# EAGLE design Rauchmelder 1.3 (EAGLE 5.04)
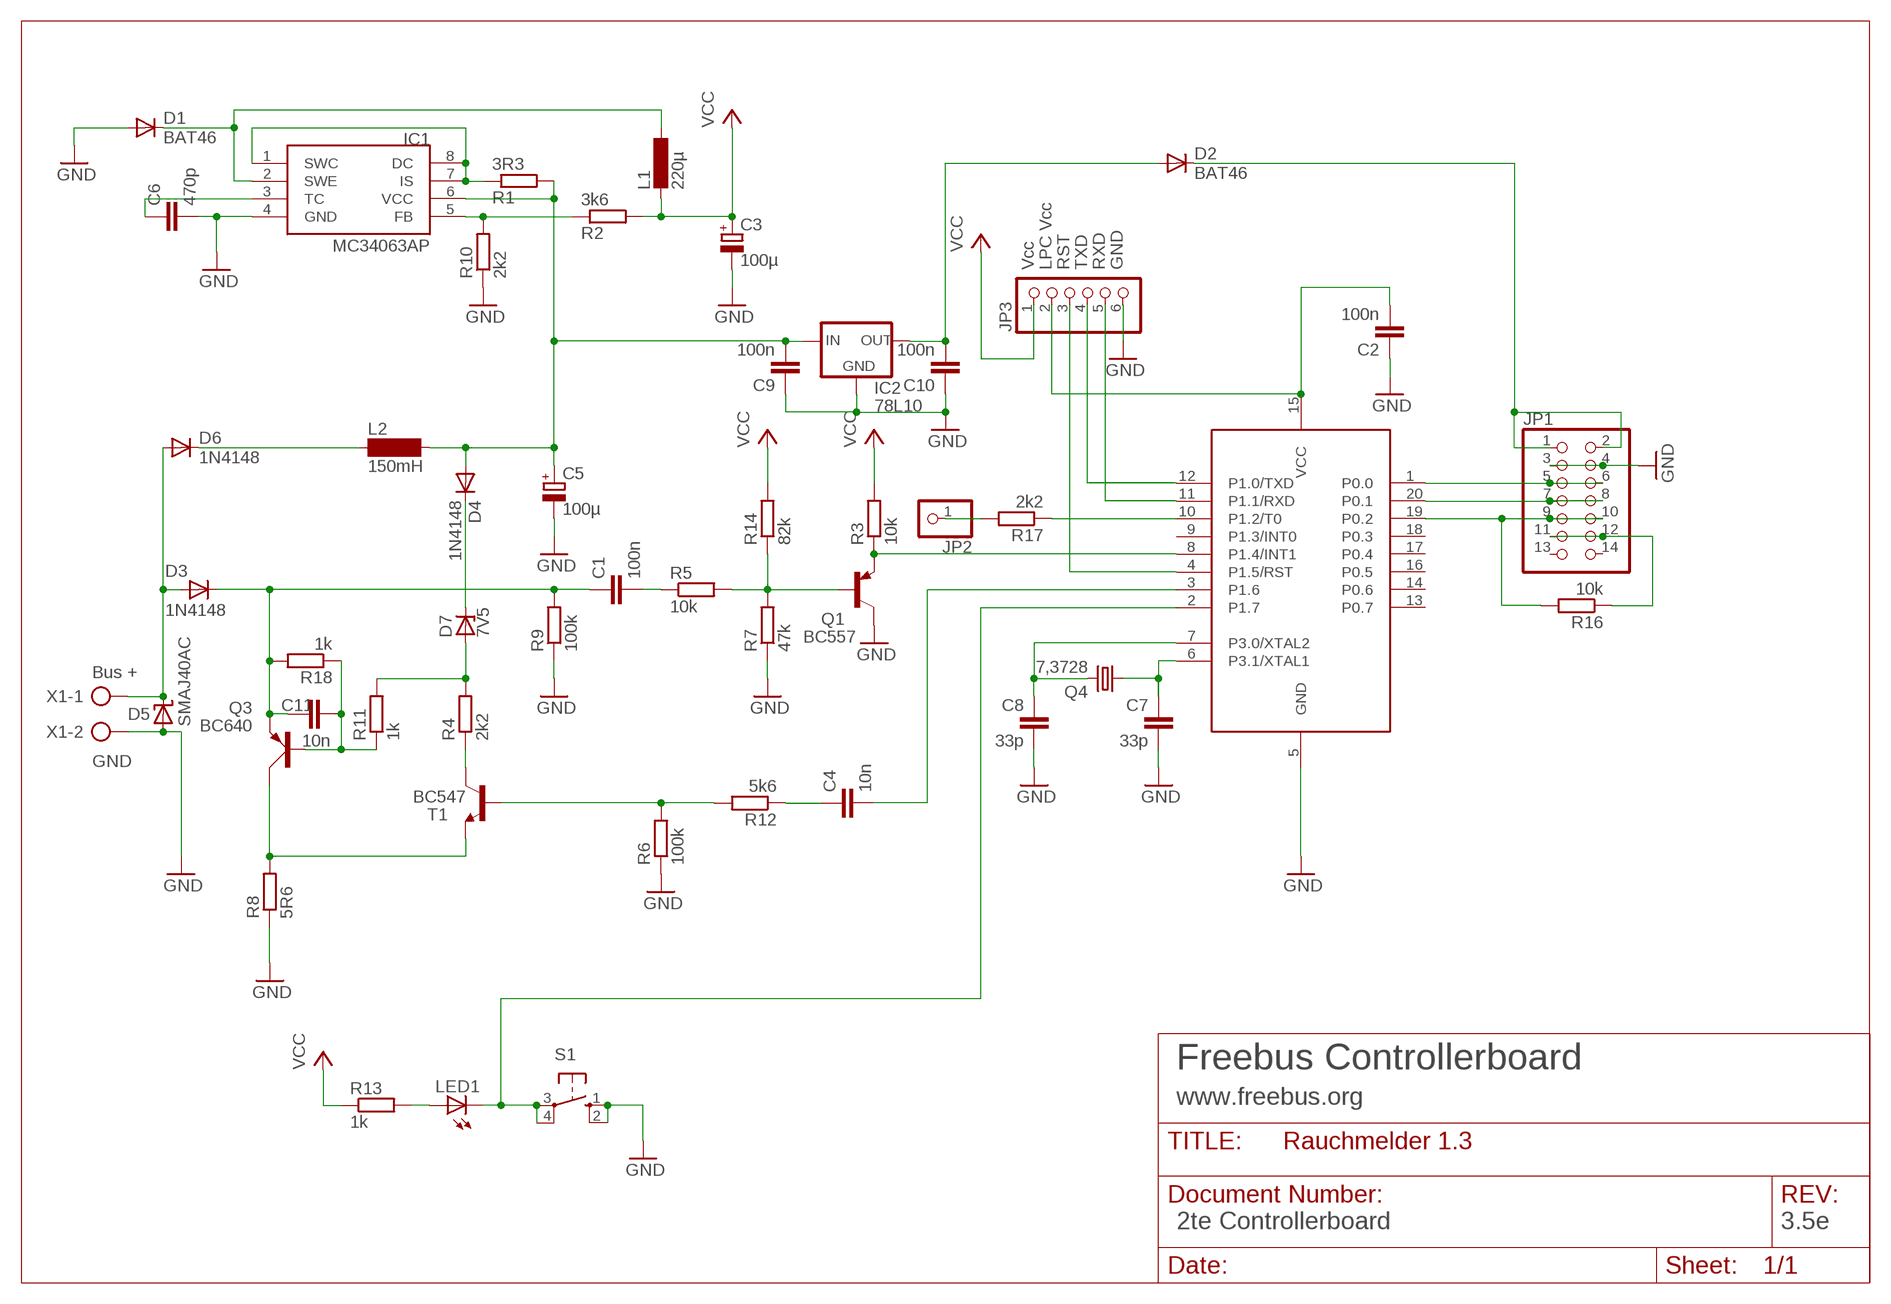
[diagram p0: schematic, sheet 1]

## Parts
89LPC922  89LPC922  [DIL20]
C1  100n  C-EU025-024X044  [C025-024X044]
C2  100n  C-EU025-024X044  [C025-024X044]
C3  100µ  CPOL-EUE2.5-6  [E2,5-6]
C4  10n  C-EU025-024X044  [C025-024X044]
C5  100µ  CPOL-EUE3.5-8  [E3,5-8]
C6  470p  C-EU025-024X044  [C025-024X044]
C7  33p  C-EU025-024X044  [C025-024X044]
C8  33p  C-EU025-024X044  [C025-024X044]
C9  100n  C-EU025-024X044  [C025-024X044]
C10  100n  C-EU025-024X044  [C025-024X044]
C11  10n  C-EU025-024X044  [C025-024X044]
D1  BAT46  BAT81  [DO34-7]
D2  BAT46  BAT81  [DO34-7]
D3  1N4148  DO35-STEHEND  [DO35-S]
D4  1N4148  [DO35-10]
D5  SMAJ40AC  SUPPRESSOR-SMBJ  [SMBJ]
D6  1N4148  [DO35-10]
D7  7V5  BZX85ZDIOV  [ZDIO-2.5]
IC1  MC34063AP  [DIL08]
IC2  78L10  78LXX  [78LXX]
JP1  PINHD-2X7  [2X07]
JP2  PINHD-1X1  [1X01]
JP3  PINHD-1X6  [1X06]
L1  220µ  L-EU0207/12  [0207/12]
L2  150mH  BS11  [BS11]
LED1  LED3MM  [LED3MM]
Q1  BC557  [TO92]
Q3  BC640  [SOT54D]
Q4  7,3728  CRYSTALHC49S  [HC49/S]
R1  3R3  R-EU_0207/7  [0207/7]
R2  3k6  R-EU_0207/7  [0207/7]
R3  10k  R-EU_0207/7  [0207/7]
R4  2k2  R-EU_0207/2V  [0207/2V]
R5  10k  R-EU_0207/7  [0207/7]
R6  100k  R-EU_0207/2V  [0207/2V]
R7  47k  R-EU_0207/7  [0207/7]
R8  5R6  R-EU_0207/7  [0207/7]
R9  100k  R-EU_0207/7  [0207/7]
R10  2k2  R-EU_0207/7  [0207/7]
R11  1k  R-EU_0207/2V  [0207/2V]
R12  5k6  R-EU_0207/7  [0207/7]
R13  1k  R-EU_0207/7  [0207/7]
R14  82k  R-EU_0207/7  [0207/7]
R16  10k  R-EU_0207/7  [0207/7]
R17  2k2  R-EU_0207/7  [0207/7]
R18  1k  R-EU_0207/2V  [0207/2V]
S1  10-XX  [B3F-10XX]
T1  BC547  [TO92]
X1  AK500/2  [AK500/2]

## Nets
EIB+: D3.P$1(A) D5.C D6.A X1.1
GND: 89LPC922.5(GND) C2.1 C3.- C5.- C6.2 C7.2 C8.2 C9.1 C10.1 D1.A D5.A IC1.4(GND) IC2.GND JP1.3 JP1.4 JP3.6 Q1.3(C) R6.1 R7.1 R8.1 R9.1 R10.1 S1.1(S) S1.2(S1) X1.2
N$1: 89LPC922.8(P1.4/INT1) Q1.1(E) R3.1
N$2: Q1.2(B) R5.2 R7.2 R14.1
N$3: 89LPC922.7(P3.0/XTAL2) C8.1 Q4.2
N$4: C11.2 Q3.B R11.1 R18.1
N$5: 89LPC922.3(P1.6) C4.2
N$6: 89LPC922.6(P3.1/XTAL1) C7.1 Q4.1
N$7: 89LPC922.2(P1.7) LED1.K(C) S1.3(P) S1.4(P1)
N$8: IC1.1(SWC) IC1.7(IS) IC1.8(DC) R1.1
N$9: LED1.A R13.2
N$10: C10.2 D2.A IC2.OUT
N$11: IC1.5(FB) R2.1 R10.2
N$12: D1.C IC1.2(SWE) L1.1
N$13: D6.C L2.1
N$14: C6.1 IC1.3(TC)
N$15: D4.C D7.C
N$16: C1.2 R5.1
N$17: C5.+ C9.2 D4.A IC1.6(VCC) IC2.IN L2.2 R1.2
N$18: D2.C JP1.1 JP1.2
N$19: 89LPC922.1(P0.0) JP1.5 JP1.6
N$20: 89LPC922.20(P0.1) JP1.7 JP1.8
N$21: 89LPC922.19(P0.2) JP1.9 JP1.10 R16.2
N$22: C4.1 R12.1
N$23: R4.1 T1.3(C)
N$24: JP1.11 JP1.12 R16.1
N$25: D7.A R4.2 R11.2
N$26: Q3.C R8.2 T1.1(E)
N$27: 89LPC922.10(P1.2/T0) R17.1
N$28: JP2.1 R17.2
N$29: 89LPC922.12(P1.0/TXD) JP3.4
N$30: 89LPC922.11(P1.1/RXD) JP3.5
N$31: 89LPC922.4(P1.5/RST) JP3.3
N$32: 89LPC922.15(VCC) C2.2 JP3.2
N$33: C1.1 C11.1 D3.P$2(B) Q3.E R9.2 R18.2
N$34: R6.2 R12.2 T1.2(B)
VCC: C3.+ JP3.1 L1.2 R2.2 R3.2 R13.1 R14.2
Unconnected: 89LPC922.9(P1.3/INT0) 89LPC922.13(P0.7) 89LPC922.14(P0.6) 89LPC922.16(P0.5) 89LPC922.17(P0.4) 89LPC922.18(P0.3) JP1.13 JP1.14

## Notes on the sheet
- Vcc | LPC Vcc | RST | TXD | RXD | GND
- Bus +
- GND
- Freebus Controllerboard
- www.freebus.org
- 2te Controllerboard | 3.5e

## Library data of the parts
89LPC922 = micro-philips:89LPC922
C1 C2 C4 C6-C11 = rcl:C-EU: CAPACITOR, European symbol
C3 C5 = rcl:CPOL-EU: POLARIZED CAPACITOR, European symbol
D1 D2 = diode:BAT81: DIODE barrier diode
D3 = kubi:DO35-STEHEND
D4 D6 = diode:1N4148: DIODE high speed (Philips)
D5 = diode:SUPPRESSOR-: Suppressor diode
D7 = diode:BZX85: Z DIODE
IC1 = mc34063:MC34063
IC2 = v-reg:78LXX: VOLTAGE REGULATOR
JP1 = pinhead:PINHD-2X7: PIN HEADER
JP2 = pinhead:PINHD-1X1: PIN HEADER
JP3 = pinhead:PINHD-1X6: PIN HEADER
L1 = rcl:L-EU: INDUCTOR, European symbol
L2 = inductor-neosid:BS: INDUCTOR nominal inductance, magnetically screened
LED1 = led:LED: LED OSRAM: - CHIPLED LG R971, LG N971, LY N971, LG Q971, LY Q971, LO R971, LY R971 LH N974, LH R974 LS Q976, LO Q976, LY Q976 LO Q996 - Hyper CHIPLED LW Q18S LB Q993, LB Q99A, LB R99A - SideLED LS A670, LO A670, LY A670, LG A670, LP A670 LB A673, LV A673, LT A673, LW A673 LH A674 LY A675 LS A676, LA A676, LO A676, LY A676, LW A676 LS A679, LY A679, LG A679 - Hyper Micro SIDELED® LS Y876, LA Y876, LO Y876, LY Y876 LT Y87S - SmartLED LW L88C, LW L88S LB L89C, LB L89S, LG L890 LS L89K, LO L89K, LY L89K LS L896, LA L896, LO L896, LY L896 - TOPLED LS T670, LO T670, LY T670, LG T670, LP T670 LSG T670, LSP T670, LSY T670, LOP T670, LYG T670 LG T671, LOG T671, LSG T671 LB T673, LV T673, LT T673, LW T673 LH T674 LS T676, LA T676, LO T676, LY T676, LB T676, LH T676, LSB T676, LW T676 LB T67C, LV T67C, LT T67C, LS T67K, LO T67K, LY T67K, LW E67C LS E67B, LA E67B, LO E67B, LY E67B, LB E67C, LV E67C, LT E67C LW T67C LS T679, LY T679, LG T679 LS T770, LO T770, LY T770, LG T770, LP T770 LB T773, LV T773, LT T773, LW T773 LH T774 LS E675, LA E675, LY E675, LS T675 LS T776, LA T776, LO T776, LY T776, LB T776 LHGB T686 LT T68C, LB T68C - Hyper Mini TOPLED® LB M676 - Mini TOPLED Santana® LG M470 LS M47K, LO M47K, LY M47K Source: http://www.osram.convergy.de - LUMILED® LXK2-PW12-R00, LXK2-PW12-S00, LXK2-PW14-U00, LXK2-PW14-V00 LXK2-PM12-R00, LXK2-PM12-S00, LXK2-PM14-U00 LXK2-PE12-Q00, LXK2-PE12-R00, LXK2-PE12-S00, LXK2-PE14-T00, LXK2-PE14-U00 LXK2-PB12-K00, LXK2-PB12-L00, LXK2-PB12-M00, LXK2-PB14-N00, LXK2-PB14-P00, LXK2-PB14-Q00 LXK2-PR12-L00, LXK2-PR12-M00, LXK2-PR14-Q00, LXK2-PR14-R00 LXK2-PD12-Q00, LXK2-PD12-R00, LXK2-PD12-S00 LXK2-PH12-R00, LXK2-PH12-S00 LXK2-PL12-P00, LXK2-PL12-Q00, LXK2-PL12-R00 Source: www.luxeon.com
Q1 = transistor-pnp:BC557: PNP Transistor
Q3 = transistor-small-signal:BC640: PNP TRANSISTOR
Q4 = crystal:CRYSTAL: CRYSTAL
R1-R14 R16-R18 = rcl:R-EU_: RESISTOR, European symbol
S1 = switch-omron:10-XX: OMRON SWITCH
T1 = transistor-neu-to92:BC547: NPN TRANSISTOR
X1 = con-ptr500:AK500/2: CONNECTOR

## Board
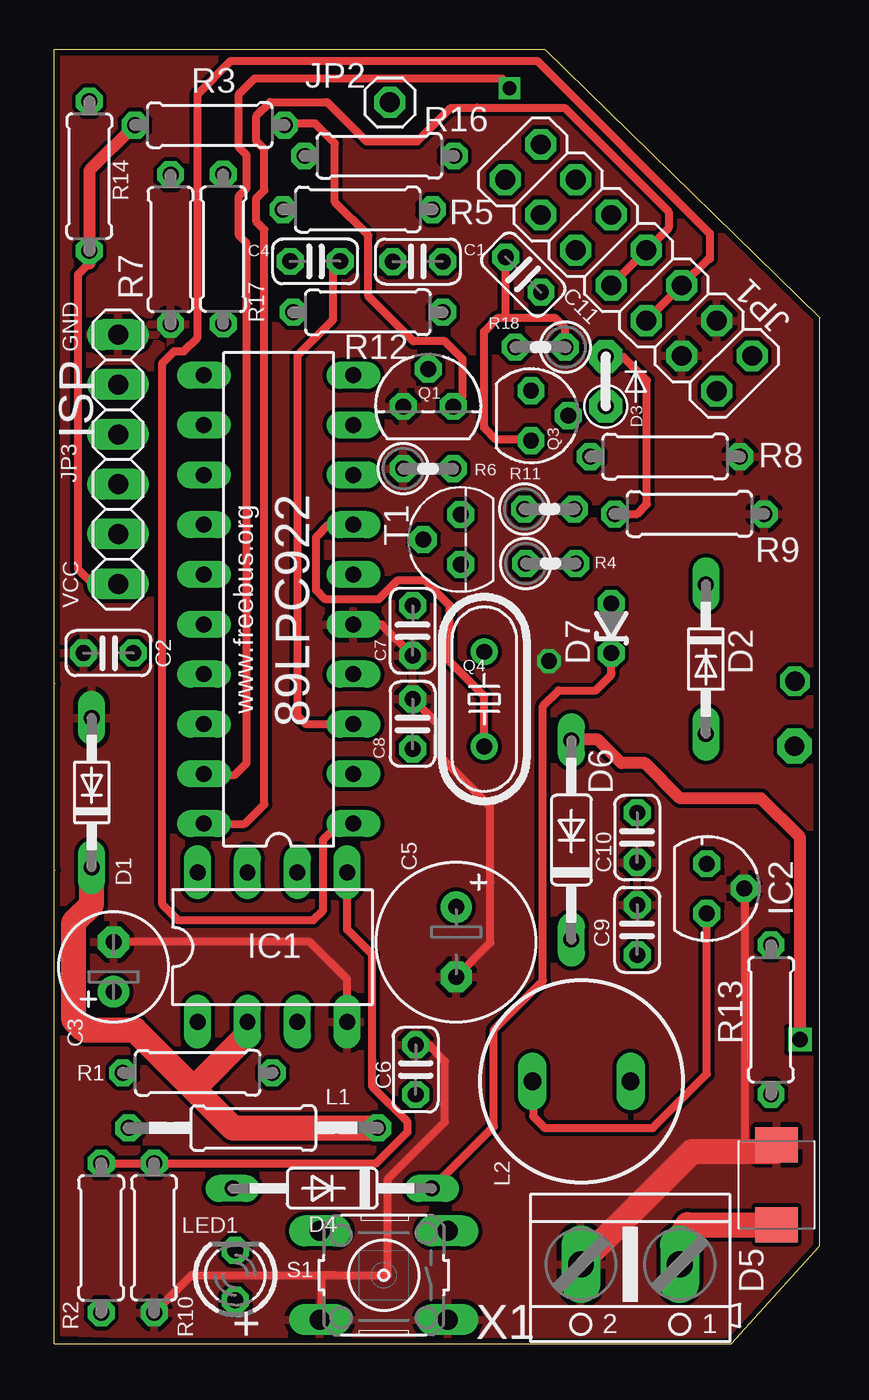
[diagram p1: board, top side]
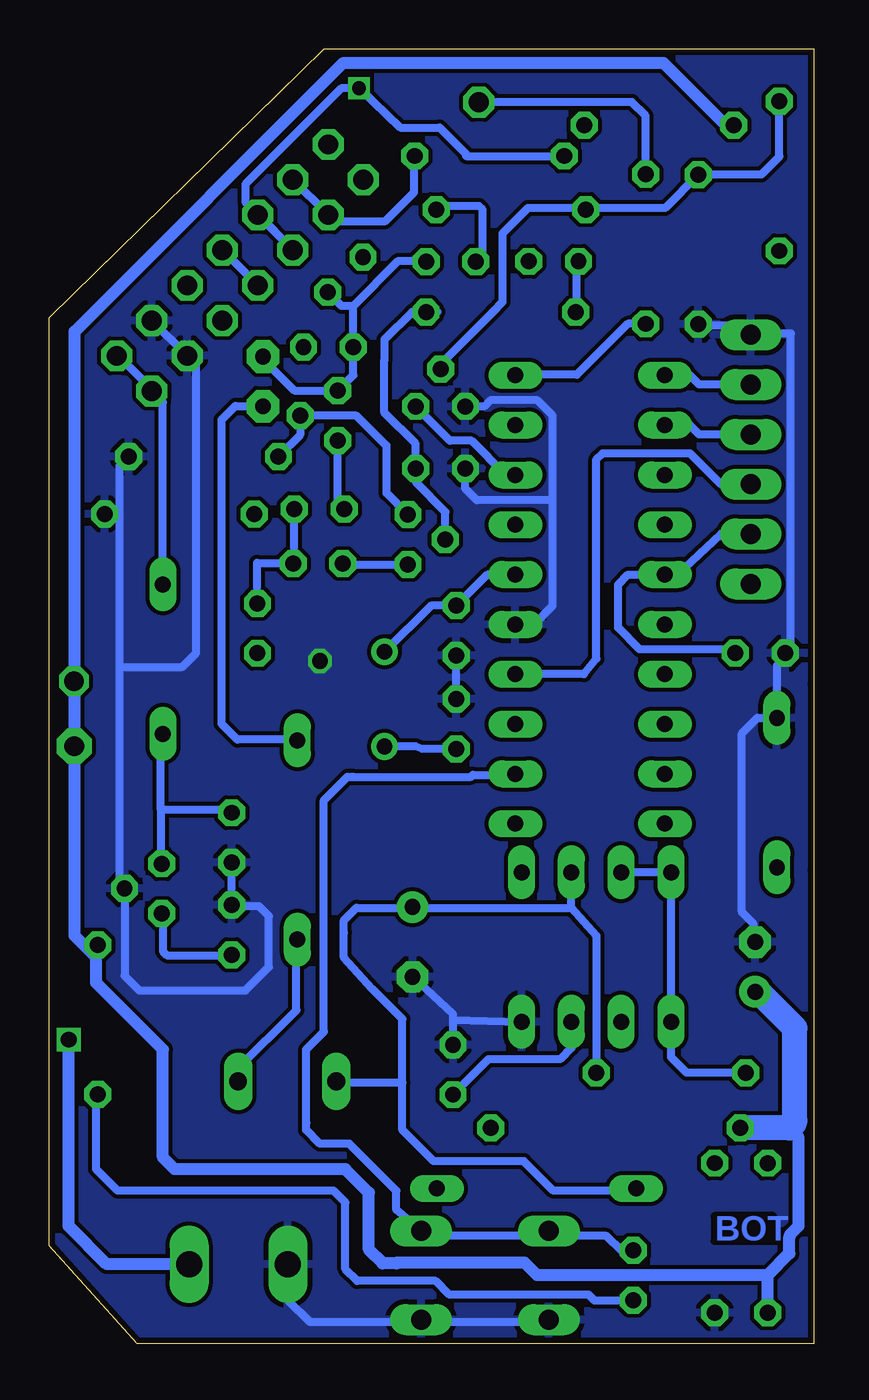
[diagram p2: board, bottom side, seen from below]

Size 39 x 66 mm. Coordinates in mm from the lower left corner, seen from the top.
Outline: 0,33.66 0.04,33.66
Outline: 0.04,24.13 0,24.13
Outline: 0,0 0,66 25,66 39,52.3 39,5 34.5,0 0,0
Copper layers (1*16): Top 0.035mm / dielectric 1.5mm / Bottom 0.035mm
Design rules "default_freebus": minimum track width 10mil, minimum drill 24mil, track to track 8mil, track to pad 8mil, pad to pad 8mil, via to via 8mil, smd to smd 8mil, copper to edge 12mil, drill to drill 8mil, minimum pad ring 11mil, minimum via ring 8mil, stop-mask expansion 4mil, vias tented up to drill 0mil, thermal gap 10mil

### Footprints (pad centres in the part's own frame; a part is rotated, then mirrored left to right if it is on the bottom)
DIL20@1 = drill 0.813 long: 1 -11.43,-3.81; 2 -8.89,-3.81; 3 -6.35,-3.81; 4 -3.81,-3.81; 5 -1.27,-3.81; 6 1.27,-3.81; 7 3.81,-3.81; 8 6.35,-3.81; 9 8.89,-3.81; 10 11.43,-3.81; 11 11.43,3.81; 12 8.89,3.81; 13 6.35,3.81; 14 3.81,3.81; 15 1.27,3.81; 16 -1.27,3.81; 17 -3.81,3.81; 18 -6.35,3.81; 19 -8.89,3.81; 20 -11.43,3.81
C025-024X044 = drill 0.813 octagon: 1 -1.27,0; 2 1.27,0
E2,5-6 = drill 0.813 pad 1.6 round: + -1.27,0 | drill 0.813 pad 1.6 octagon: - 1.27,0
E3,5-8 = drill 0.813 pad 1.6 round: + -1.778,0 | drill 0.813 pad 1.6 octagon: - 1.778,0
DO34-7 = drill 0.813 long: A 3.81,0; C -3.81,0
DO35-S = drill 0.8 pad 1.676 octagon: P$1 -1.27,0; P$2 1.27,0
DO35-10 = drill 0.813 long: A 5.08,0; C -5.08,0
SMBJ = smd 1.78 x 2.16: A 2.04,0; C -2.03,0
ZDIO-2.5 = drill 0.813 octagon: A 1.27,0; C -1.27,0
DIL08 = drill 0.813 long: 1 -3.81,-3.81; 2 -1.27,-3.81; 3 1.27,-3.81; 4 3.81,-3.81; 5 3.81,3.81; 6 1.27,3.81; 7 -1.27,3.81; 8 -3.81,3.81
78LXX = drill 0.813 octagon: GND 0,1.905; IN 1.27,0; OUT -1.27,0
2X07 = drill 1.016 octagon: 1 -7.62,-1.27; 2 -7.62,1.27; 3 -5.08,-1.27; 4 -5.08,1.27; 5 -2.54,-1.27; 6 -2.54,1.27; 7 0,-1.27; 8 0,1.27; 9 2.54,-1.27; 10 2.54,1.27; 11 5.08,-1.27; 12 5.08,1.27; 13 7.62,-1.27; 14 7.62,1.27
1X01 = drill 1.016 octagon: 1 0,0
1X06 = drill 1.016 long: 1 -6.35,0; 2 -3.81,0; 3 -1.27,0; 4 1.27,0; 5 3.81,0; 6 6.35,0
0207/12 = drill 0.813 octagon: 1 -6.35,0; 2 6.35,0
BS11 = drill 0.9 long: 1 -2.5,0; 2 2.5,0
LED3MM = drill 0.813 octagon: A -1.27,0; K 1.27,0
TO92 = drill 0.813 octagon: 1 1.27,0; 2 0,1.905; 3 -1.27,0
SOT54D = drill 0.813 octagon: B 1.27,0; C 0,1.905; E -1.27,0
HC49/S = drill 0.813 round: 1 -2.413,0; 2 2.413,0
0207/7 = drill 0.813 octagon: 1 -3.81,0; 2 3.81,0
0207/2V = drill 0.813 octagon: 1 -1.27,0; 2 1.27,0
B3F-10XX = drill 1.016 long: 1 -3.251,2.261; 2 3.251,2.261; 3 -3.251,-2.261; 4 3.251,-2.261
AK500/2 = drill 1.321 long: 1 -2.515,0; 2 2.515,0

### Placement (x,y rotation side)
89LPC922  89LPC922  [DIL20@1]  11.43,37.94 90 top
C1  18.52,55.17 180 top
C2  2.76,35.2 0 top
C3  3.02,19.21 90 top
C4  13.29,55.18 0 top
C5  20.48,20.48 270 top
C6  18.42,13.97 90 top
C7  18.26,36.35 270 top
C8  18.26,31.59 90 top
C9  29.7,21.1 270 top
C10  29.7,25.8 90 top
C11  23.9,54.5 135 top
D1  1.91,28.1 90 top
D2  33.2,34.9 270 top
D3  28.1,49.05 90 top
D4  14.16,7.92 180 top
D5  36.8,8.1 90 top
D6  26.35,25.68 90 top
D7  28.38,36.47 90 top
IC1  11.11,20.22 0 top
IC2  33.25,23.2 270 top
JP1  29.27,54.85 135 top
JP2  17.1,63.28 0 top
JP3  3.25,45.09 90 top
L1  10.14,11 180 top
L2  26.86,13.38 180 top
LED1  9.22,3.49 90 top
Q1  19.05,47.78 0 top
Q3  24.29,47.31 270 top
Q4  21.91,32.86 270 top
R1  7.3,13.81 0 top
R2  2.38,5.4 270 top
R3  7.92,62.12 180 top
R4  25.3,39.77 0 top
R5  15.46,57.82 180 top
R6  19.05,44.61 0 top
R7  5.92,55.78 90 top
R8  31.12,45.22 180 top
R9  32.36,42.3 180 top
R10  5.08,5.4 90 top
R11  25.23,42.56 0 top
R12  15.98,52.58 0 top
R13  36.52,16.52 270 top
R14  1.78,59.52 270 top
R16  16.56,60.55 180 top
R17  8.6,55.8 90 top
R18  24.77,50.8 180 top
S1  16.79,3.49 180 top
T1  20.71,41 90 top
X1  29.35,4.05 180 top

### Tracks (layer width: path | path; a pad name or v marks a point on that pad's centre or on a via)
EIB+  (via drill 0.8)
  Top 0.61: v38,15.5 38,25.8 36,27.8 31.9,27.8 30.1,29.6 28.9,29.6 27.7,30.8 26.39,30.8 D6.A
  Top 1.27: D5.C 32.27,6.07 31.9,5.4 31.9,4.08 X1.1
  Bottom 0.406: D3.P$1 28.1,47.8 29.5,47.8 30.2,47.1 30.2,31.6 29.4,30.8 26.31,30.8 | 26.31,30.8 26.3,30.8 | D6.A 26.31,30.8
  Bottom 0.61: X1.1 36.05,4.05 38,6 v38,15.5
GND  (via drill 0.8)
  Top 0.406: 89LPC922.5 16.67,36.67 C7.2 | 14.29,3.49 6.99,3.49 R10.1 | R10.1 | R10.1 | R10.1 | IC1.4 14.92,16.51 14.92,18.41 14.92,18.57 13.02,20.48 C3.- | C3.- | C8.2 19.53,31.59 19.53,31 19.5,31 19.5,30.1 22.2,27.4 22.2,23.52 22.23,23.5 22.23,20.45 C5.- | 14.29,3.49 17,3.49 17,8.4 19.9,11.3 19.9,14.4 19,15.3 18.4,15.3 18.4,15.26 C6.2 | 14.29,3.49 14.28,3.5 13.7,3.5 13.6,3.4 13.6,1.1 S1.2 | 35.2,23.25 35.2,23.3 | 35.2,23.25 IC2.GND | 35.2,14.4 35.2,23.25 | 35.2,14.4 35.2,13.9 | 35.2,9.8 35.2,14.4
  Top 1.27: X1.2 26.84,4.13 32.5,9.8 35.2,9.8 36.76,9.8 D5.A
  Bottom 0.406: Q1.3 16.83,47.78 16.51,48.1 14.13,48.1 13.34,47.31 13.34,43 | 89LPC922.5 14.29,36.67 13.34,37.62 13.34,43 | C8.2 C7.2 | D1.A | D1.A | C6.2 | 18.42,16.51 IC1.4 | C6.2 18.42,16.51 | C5.- 18.42,16.8 18.42,16.51 | S1.2 13.6,1.1 20,1.1 | 20,1.1 20.1,1.1 S1.1 20,1.07 20,1.1 | 20,1.1 25.7,1.1 26.8,2.2 26.8,4.01 X1.2 | D1.A 1.91,31.9 2.9,31.9 3.7,31.1 3.7,22 3.1,21.4 3.1,20.4 C3.- | 1.28,35.2 1.2,35.2 1.2,51.5 3.18,51.5 JP3.6 3.71,51.9 5.9,51.9 5.9,51.95 R7.1 | 1.28,35.2 C2.1 | C9.1 29.7,22.3 | C9.1 C10.1 | JP1.3 33.8,52.2 | JP1.3 | JP1.4 | JP1.4 JP1.3 | JP1.4 31.96,50.26 31.5,49.8 31.5,35.2 32.2,34.5 35.4,34.5 | R8.1 35.4,44.75 35.4,42.3 | 35.4,34.5 35.4,23.4 35.2,23.2 IC2.GND 35.16,18.75 34.4,18 29,18 27.8,19.2 27.8,21.8 28.3,22.3 29.63,22.3 C9.1 | 35.4,34.5 35.4,42.3 | 35.4,42.3 R9.1 | R6.1 17.8,44.59 17.8,43.6 17.2,43 13.34,43 | D1.A 1.9,34.58 1.28,35.2
  other vias: 25.2,34.8
  pour Top: -1.2,0.6 -1.2,66.1 -0.7,66.6 25.9,66.6 39.9,52.6 39.9,2.7 36.6,-0.6
  pour Bottom: -0.7,66.7 26.3,66.7 40.4,52.6 40.4,3.1 35.9,-1.4 -0.5,-1.4 -1.7,-0.2
N$1
  Top 0.406: Q1.1 20.8,48.26 20.8,50.2 19.9,51.1 18.3,51.1 16,53.4 16,56.5 14.3,58.2 14.3,61.2 13.3,62.2 11.71,62.2 | 11.71,62.2 11.7,62.2 | 11.71,62.2 R3.1
  Bottom 0.406: 89LPC922.8 15.72,44.29 | 15.72,44.29 | 15.72,44.29 17.46,46.04 18.57,46.04 Q1.1
N$2
  Bottom 0.406: 11.57,57.9 R5.2 | 11.57,57.9 14.6,57.9 15.9,56.6 15.9,53.1 16.4,52.6 | Q1.2 19,49.74 19,50 16.4,52.6 | 16.4,52.6 16.3,52.7 | R14.1 1.78,60.52 2.7,59.6 R7.2 7.61,57.9 11.57,57.9
N$3
  Top 0.406: 89LPC922.7 14.29,41.75 13.97,41.75 13.34,41.12 13.34,38.42 13.81,37.94 16.51,37.94 17.46,38.89 18.89,38.89 20.16,37.62 20.16,34.77 21.91,33.02 Q4.2
  Bottom 0.406: Q4.2 20.32,30.45 20,30.32 C8.1
N$4
  Top 0.406: R18.1 26,50.84 26,51.8 25.5,52.3 23,52.3 | 23,52.3 22.6,52.3 21.9,51.6 21.9,46.7 22.5,46.1 24.3,46.1 Q3.B | C11.2 23,52.3
  Bottom 0.406: Q3.B 24.3,46.1 | Q3.B | R11.1 24.3,42.9 Q3.B
N$5
  Top 0.406: C4.2 14.2,54.74 14.2,52.2 12.4,50.4 12.4,32 12.8,31.6 89LPC922.3
N$6
  Bottom 0.406: Q4.1 19.53,37.62 C7.1 16.67,39.21 15.4,39.21 89LPC922.6
N$7
  Bottom 0.406: 19.98,5.5 19.9,5.5 | 19.98,5.5 S1.3 21.3,6.82 21.3,7.8 23.7,10.2 25.2,10.2 25.9,10.9 25.9,11.3 | 19.98,5.5 13.5,5.5 13.5,5.52 S1.4 13.48,5.5 10.6,5.5 9.8,4.7 9.2,4.7 9.2,4.74 LED1.K | 25.9,11.3 25.9,11.2 | 23.5,28.9 17.5,28.9 17.4,29 15.19,29 | 23.5,28.9 23.6,28.9 | 15.19,29 15.1,29 | 15.19,29 89LPC922.2 | 25.9,11.3 25.9,15 25,15.9 25,27.7 23.8,28.9 23.5,28.9
N$8
  Bottom 0.406: IC1.7 | IC1.7 IC1.8 7.3,24.13 7.3,16.51 | IC1.7 | R1.1 5.24,13.81 6.51,13.81 7.3,14.61 7.3,16.51 | 7.3,16.51 | 7.3,16.51 IC1.1
N$9
  Bottom 0.406: 9.2,2.2 | LED1.A 9.2,2.2 | 9.2,2.2 11.2,2.2 11.5,2.5 18.6,2.5 19.3,3.2 23.3,3.2 23.9,3.8 23.9,7.2 24.5,7.8 35.5,7.8 36.6,8.9 36.6,11.93 R13.2
N$10
  Bottom 0.406: C10.2 29.63,27.07 29.6,27.1 29.7,27.2 33.3,27.2 | 33.3,24.47 33.3,24.4 | 33.3,24.47 IC2.OUT | 33.3,27.2 33.3,24.47 | D2.A 33.3,31.1 33.3,27.2
N$11
  Top 0.406: 14.92,24.13 | 14.92,24.13 IC1.5 | 14.92,24.13 14.92,21.11 16.19,19.84 16.19,14.45 16.2,14.44 16.2,13.1 18,11.3 18,10.8 16.41,9.21 R10.2 2.54,9.21 R2.1 | R2.1
N$12
  Top 1.27: D1.C 1.91,22.41 1,21.5 1,16.5 1.5,16 4.1,16 7.1,13 | 7.1,13 9.1,11 L1.1 | IC1.2 9.84,15.74 7.1,13
N$13
  Bottom 0.406: 29.4,13.34 29.4,13.3 | L2.1 29.4,13.34 | 29.4,13.34 29.4,14 26.4,17 26.4,20.6 D6.C
N$14
  Bottom 0.406: IC1.3 12.38,16.51 12.38,15.08 12.96,14.51 16.61,14.51 17.46,13.65 C6.1 | C6.1
N$15
  Top 0.406: D4.C 22.4,11.08 22.4,16 24.9,18.5 24.9,32.5 25.7,33.3 27.6,33.3 28.31,34.01 arc45 28.38,34.19 D7.C
N$16
  Bottom 0.406: C1.2 16.9,55.22 16.9,57.8 17.1,58 19.1,58 19.1,57.99 R5.1
N$17
  Top 0.406: IC2.IN 33.25,13.75 30.5,11 25,11 24.4,11.6 24.4,13.4 24.38,13.38 L2.2
  Bottom 0.406: 12.38,24.13 | 12.38,24.13 IC1.6 | 12.38,22.23 12.38,24.13 | 23.97,20.95 23.97,19.68 22.54,18.1 21,16.55 21,13.3 | 20.48,22.23 12.38,22.23 | 20.48,22.23 23.34,22.23 23.97,21.59 23.97,20.95 | 23.97,20.95 | R1.2 11.11,13.97 11.11,20.8 12.38,22.23 | C5.+ | 20.48,22.23 C5.+ | L2.2 24.29,13.3 21,13.3 | IC2.IN 33.2,21.88 33.2,20 33,19.8 29.73,19.8 C9.2 | D4.A 9,7.8 13.3,7.8 14.8,9.3 19.4,9.3 21,10.9 21,13.3
N$18
  Bottom 0.406: JP1.1 35.54,50.36 35.5,50.4 33.76,48.66 JP1.2 | JP1.2 33.74,48.56 33.7,48.6 33.4,48.3 | D2.C 33.2,48 33.8,48.6 | 33.8,48.6 JP1.2 | 33.8,48.6 33.9,48.6
N$19
  Top 0.406: 89LPC922.1 15.3,26.5 | 89LPC922.1 | 89LPC922.1 14.5,26.5 13.7,25.7 13.7,22.1 13.2,21.6 6.3,21.6 5.5,22.4 5.5,50 6.1,50.6 6.6,50.6 7.3,51.3 7.3,63.7 9,65.4 24.6,65.4 33.4,56.6 33.4,55.3 33.31,55.3 JP1.5 JP1.6
N$20
  Top 0.406: JP1.8 31.3,56.88 31.3,57.7 26,63 21.6,63 | 7.62,26.42 7.6,26.4 | 89LPC922.20 7.62,26.42 | 7.62,26.42 7.7,26.5 9.7,26.5 10.7,27.5 10.7,56.8 10.3,57.2 10.3,58.4 10.7,58.8 10.7,60.9 10.3,61.3 10.3,62.6 11,63.3 13.9,63.3 15.9,61.3 18.5,61.3 20.2,63 21.6,63 | 21.6,63 21.5,63
  Bottom 0.406: 30.17,55.77 30.2,55.8 | 30.17,55.77 JP1.7 | JP1.8 28.37,53.97 30.17,55.77
N$21  (via drill 0.7)
  Top 0.406: v23.2,64 22.8,64.5 10.2,64.5 9.4,63.7 9.4,61 9.8,60.6 9.8,58.9 9.4,58.5 9.4,56.5 9.8,56.1 9.8,29.6 9.2,29 7.6,29 7.6,29.03 89LPC922.19
  Bottom 0.406: 28.37,57.57 28.4,57.6 | 28.37,57.57 JP1.9 | 26.58,55.78 JP1.10 | 26.58,55.78 28.37,57.57 | 26.58,55.78 29,58.2 29,59.1 24.1,64 v23.2,64 21.1,62 19.1,62 17.75,60.65 17.75,60.55 R16.2
N$22
  Bottom 0.406: 12.1,54.9 12,55 | 12.1,54.9 C4.1 | R12.1 12.1,52.71 12.1,54.9
N$23
  Bottom 0.406: 24.1,39.7 | 24.1,39.7 R4.1 | T1.3 20.74,39.7 24.1,39.7
N$24
  Bottom 0.406: R16.1 20.4,60.55 20.4,58.7 21.9,57.2 24.44,57.2 JP1.12 JP1.11
N$25
  Bottom 0.406: R11.2 26.5,42.6 | R11.2 | R11.2 26.5,39.84 R4.2 26.54,39.8 | 26.54,39.8 26.5,39.8 | 26.54,39.8 28.4,39.8 arc45 28.38,39.75 D7.A
N$26
  Bottom 0.406: 21.81,45.79 21.8,45.77 | 21.81,45.79 22.23,46.2 23.34,47.31 Q3.C 26.2,46.33 R8.2 | 21.81,45.79 21.8,45.8 21.8,43.36 T1.1
N$27
  Bottom 0.406: 89LPC922.10 15.21,49.4 12.1,49.4 9.5,52 R17.1
N$28
  Bottom 0.406: R17.2 8.6,62.6 9.3,63.3 17.1,63.3 JP2.1
N$29
  Bottom 0.406: JP3.4 5.87,46.35 6.35,46.83 89LPC922.12
N$30
  Bottom 0.406: JP3.5 5.87,48.9 6.35,49.37 89LPC922.11
N$31
  Bottom 0.406: 89LPC922.4 11.75,34.13 11.11,34.92 11.11,45.09 10.8,45.4 6.35,45.4 4.76,43.81 JP3.3
N$32
  Bottom 0.406: 3.18,41.27 4.45,41.27 JP3.2 4.76,41.27 6.99,39.21 89LPC922.15 9.5,39.2 10,38.7 10,36.5 8.9,35.4 4.02,35.4 C2.2
N$33
  Top 0.406: R9.2 29.7,42.3 30.2,42.8 30.2,49.1 29,50.3 28.08,50.3 | 28.08,50.3 28,50.3 | 28.08,50.3 D3.P$2
  Bottom 0.406: Q3.E | Q3.E | Q3.E 23.5,49.37 R18.2 | Q3.E 24.31,48.6 26.5,48.6 28.1,50.2 D3.P$2 | C1.1 19.52,55.2 21.2,55.2 23.5,52.9 | R18.2 23.5,52.9 | R18.2 | C11.1 24.1,52.9 23.5,52.9
N$34
  Bottom 0.406: 20.3,44.63 20.3,44.7 | T1.2 18.8,42.4 20.3,43.9 20.3,44.63 | 20.3,44.63 20.3,44.8 | 20.3,44.63 R6.2 20.32,45.88 21.91,47.47 21.91,50.16 21.9,50.16 21.9,51.2 20.5,52.6 19.2,52.6 19.2,52.59 R12.2
VCC  (via drill 1, 1 pad 1.78)
  Top 0.406: JP3.1 3.27,38.73 3.3,38.7 2,38.7 1.2,39.5 1.2,54.5 1.78,55.08
  Top 0.61: 1.78,55.08 R14.2 1.78,59.79 R3.2
  Bottom 0.406: 21.27,4.13 21.3,4.1 | 18.4,65.3 18.3,65.4 | 37.7,30.5 37.7,30.6 37.7,30.48 | 37.7,30.5 37.7,30.46 v37.72,30.46 37.7,30.48 | v37.73,33.77 37.7,33.77 37.7,33.4 | 37.7,30.5 37.7,30.48 | 4.62,62.22 R3.2 | 36.6,19.7 36.53,19.63 R13.1 | 10.64,3.49 | 2.38,3.49 | R2.2
  Bottom 0.61: 21.27,4.13 14.76,4.13 14.13,3.49 10.64,3.49 6.19,3.49 2.38,3.49 | 2.38,3.49 1.27,4.6 1.27,5.42 arc45 1.2,5.6 0.8,6 0.8,10.42 arc-45 0.87,10.6 1.27,10.99 | R2.2 2.38,3.49 | 21.3,4.1 22,4.1 22.7,4.8 22.7,7.7 23.9,8.9 32.6,8.9 33.2,9.5 33.2,15 36.6,18.4 36.6,19.7 37.7,20.8 37.7,30.6 37.7,33.4 37.7,51.6 24,65.3 18.4,65.3 7.7,65.3 4.62,62.22
  Bottom 1.27: C3.+ 2.94,17.94 arc45 2.77,17.86 1,16.1 1,11.37 arc45 1.07,11.19 1.27,10.99 L1.2 | L1.2 arc-45 L1.2

### Text on the board
Bottom: BOT
tPlace: +
tNames: GND | ISP | VCC | www.freebus.org